# EAGLE schematic schematic (EAGLE 6.6.0)
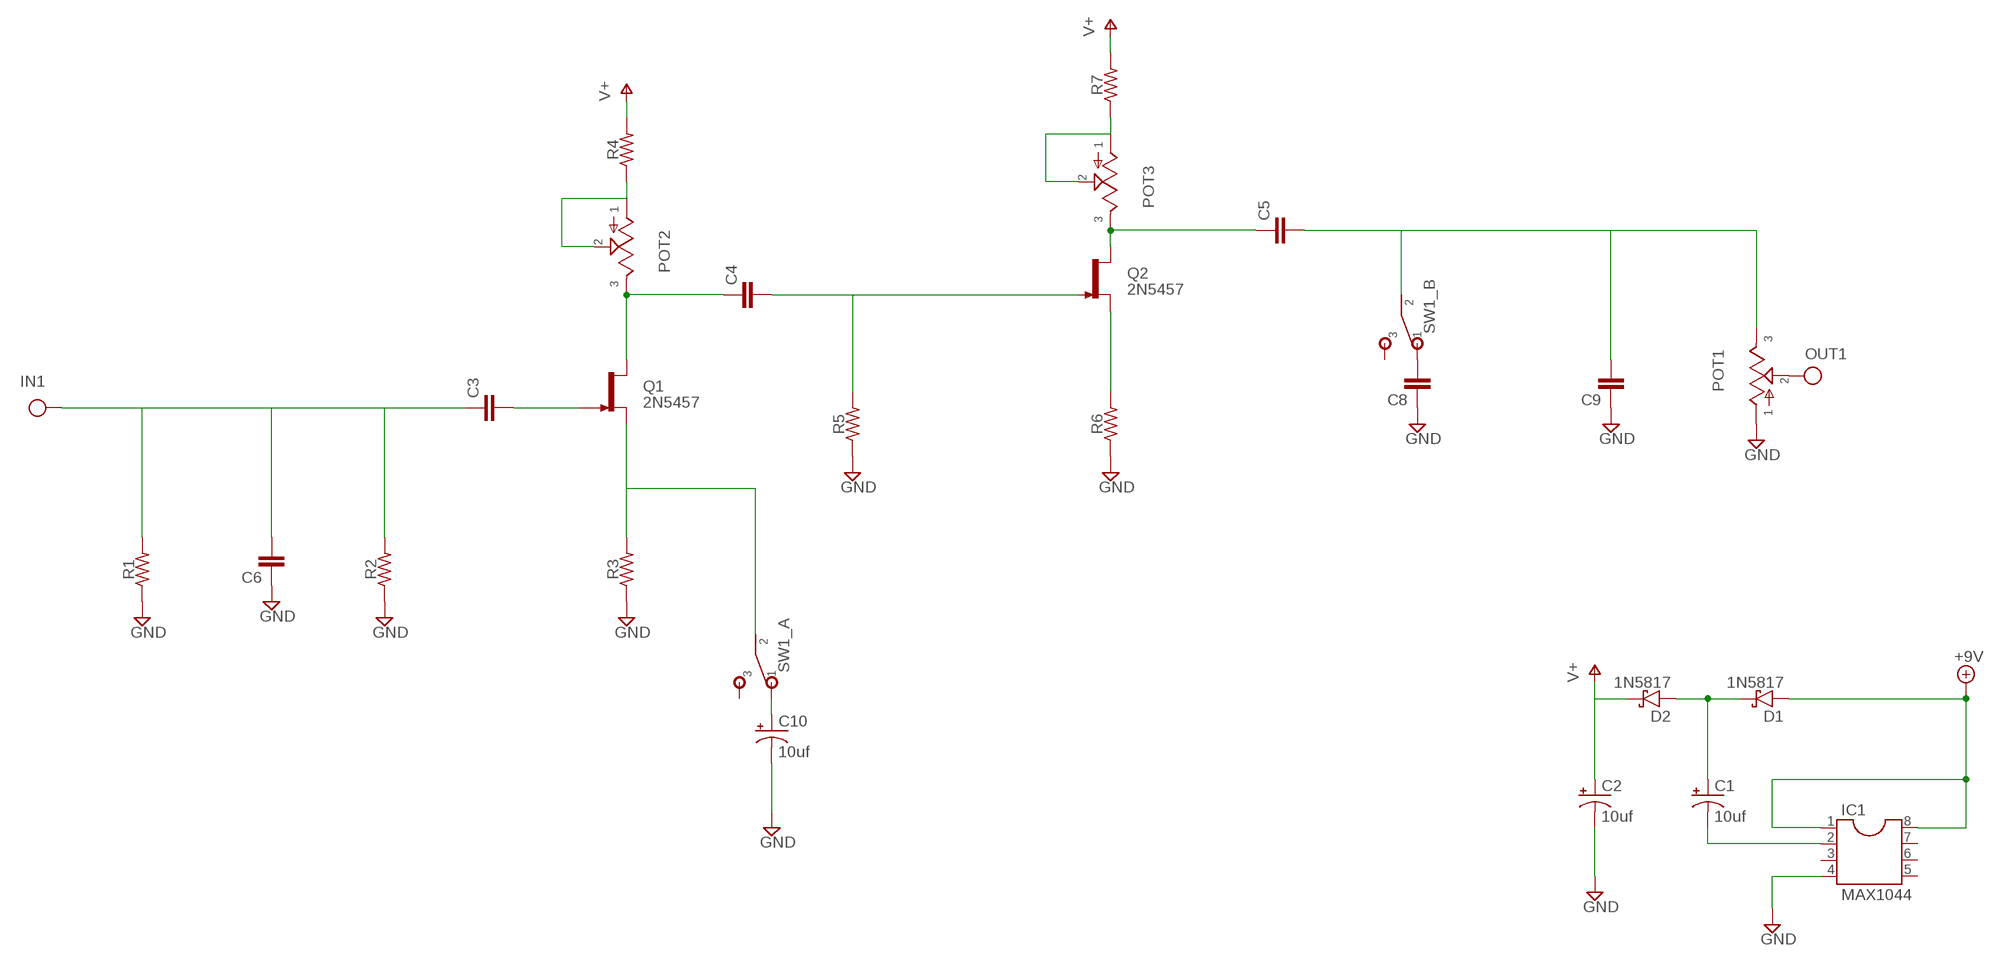
[diagram p0: schematic, sheet 1]

## Parts
C1  10uf  0501  [050_020_1]
C2  10uf  0501  [050_020_1]
C3  072X0252  [072X025]
C4  072X0252  [072X025]
C5  072X0252  [072X025]
C6  072X0252  [072X025]
C8  072X0252  [072X025]
C9  072X0252  [072X025]
C10  10uf  0501  [050_020_1]
D1  1N5817  [DO41-3]
D2  1N5817  [DO41-3]
IC1  MAX1044  [DIL08]
IN1  IN(T)  [SQUARE]
OUT1  OUT(T)  [SQUARE]
POT1  POT  [POT]
POT2  POTTRIM  [B25P]
POT3  POTTRIM  [B25P]
Q1  2N5457  [TO92-]
Q2  2N5457  [TO92-]
R1  R.3B  [7.5MM.2]
R2  R.3B  [7.5MM.2]
R3  R.3B  [7.5MM.2]
R4  R.3B  [7.5MM.2]
R5  R.3B  [7.5MM.2]
R6  R.3B  [7.5MM.2]
R7  R.3B  [7.5MM.2]
SW1  DPDT.1  [DPDT_SOLDER_LUG]

## Nets
+9V: D1.A IC1.1 IC1.8
GND: C2.- C6.1 C8.1 C9.1 C10.- IC1.4 POT1.1 R1.1 R2.1 R3.1 R5.1 R6.1
IN: C3.1 C6.2 IN1.1(IN) R1.2 R2.2
N$1: C1.- IC1.2
N$2: C1.+ D1.C D2.A
N$3: C3.2 Q1.1(G)
N$4: C4.1 POT2.3 Q1.3(D)
N$5: Q1.2(S) R3.2 SW1.A2
N$6: C5.2 C9.2 POT1.3 SW1.B2
N$7: Q2.2(S) R6.2
N$8: C4.2 R5.2
N$9: C5.1 POT3.3 Q2.3(D)
N$10: C10.+ SW1.A1
N$11: C8.2 SW1.B1
N$13: POT2.1 POT2.2 R4.1
N$14: POT3.1 POT3.2 R7.1
OUT: OUT1.1(OUT) POT1.2
V+: C2.+ D2.C R4.2 R7.2
Unconnected: IC1.3 IC1.5 IC1.6 IC1.7 Q2.1(G) SW1.A3 SW1.B3

## Library data of the parts
C1 C2 C10 = gm-caps-electro-pol:050: 0.22 - 100uF Xicon values at Mouser.com: 10V: 10 - 100uF; 16V: 2.2 - 47uF; 25V: 0.47 - 47uF; 50V: 0.22 - 22uF
C3-C6 C8 C9 = gm-caps-film-box:072X025: 1000pF - 0.47uF WIMA MKP2 63, 100V: 1000pF - 0.015uF; MKS2 50V: 0.33 - 0.47uF; 63V: 1000pF - 0.22uF;
D1 D2 = gm-diodes:1N5817
IC1 = gm-ics:MAX1044
IN1 = gm-supply:IN(T): Input obsolete: use Pad instead and label net shematic input label with circuit board terminal/pad generally used only once on a schematic (because this device labels the net "IN" in the same way as a voltage supply or ground net)
OUT1 = gm-supply:OUT(T): Output obsolete: use Pad instead and label net output label with circuit board terminal/pad usually appears only once on a schematic
POT1-POT3 = gm-pots:POT: Potentiometers the arrow indicates the clockwise motion of th wiper (lug 2) fully counter clockwise there is no resistance between lugs 1 and 2 fully clockwise the resistance between lugs 1 and 2 is the value of the pot
Q1 Q2 = gm-trans:2N5457: N-CHANNEL JFET
R1-R7 = resistors:R: 1/8W, 1/4W and 1W resistors
SW1 = switches:DPDT: DPDT Toggle Switches